# Altium schematic sheet Block Diagram.SchDoc: Block Diagram
size Tabloid; ApprovedBy: NA; CompanyName: Cospan Design LLC; DrawnBy: David McCoy; Engineer: David McCoy; DocumentNumber: 1; Revision: A; SheetNumber: 1; SheetTotal: 18; Client: OSH; Project: Guppy Buddy; ProjectPrettyName: Guppy Buddy
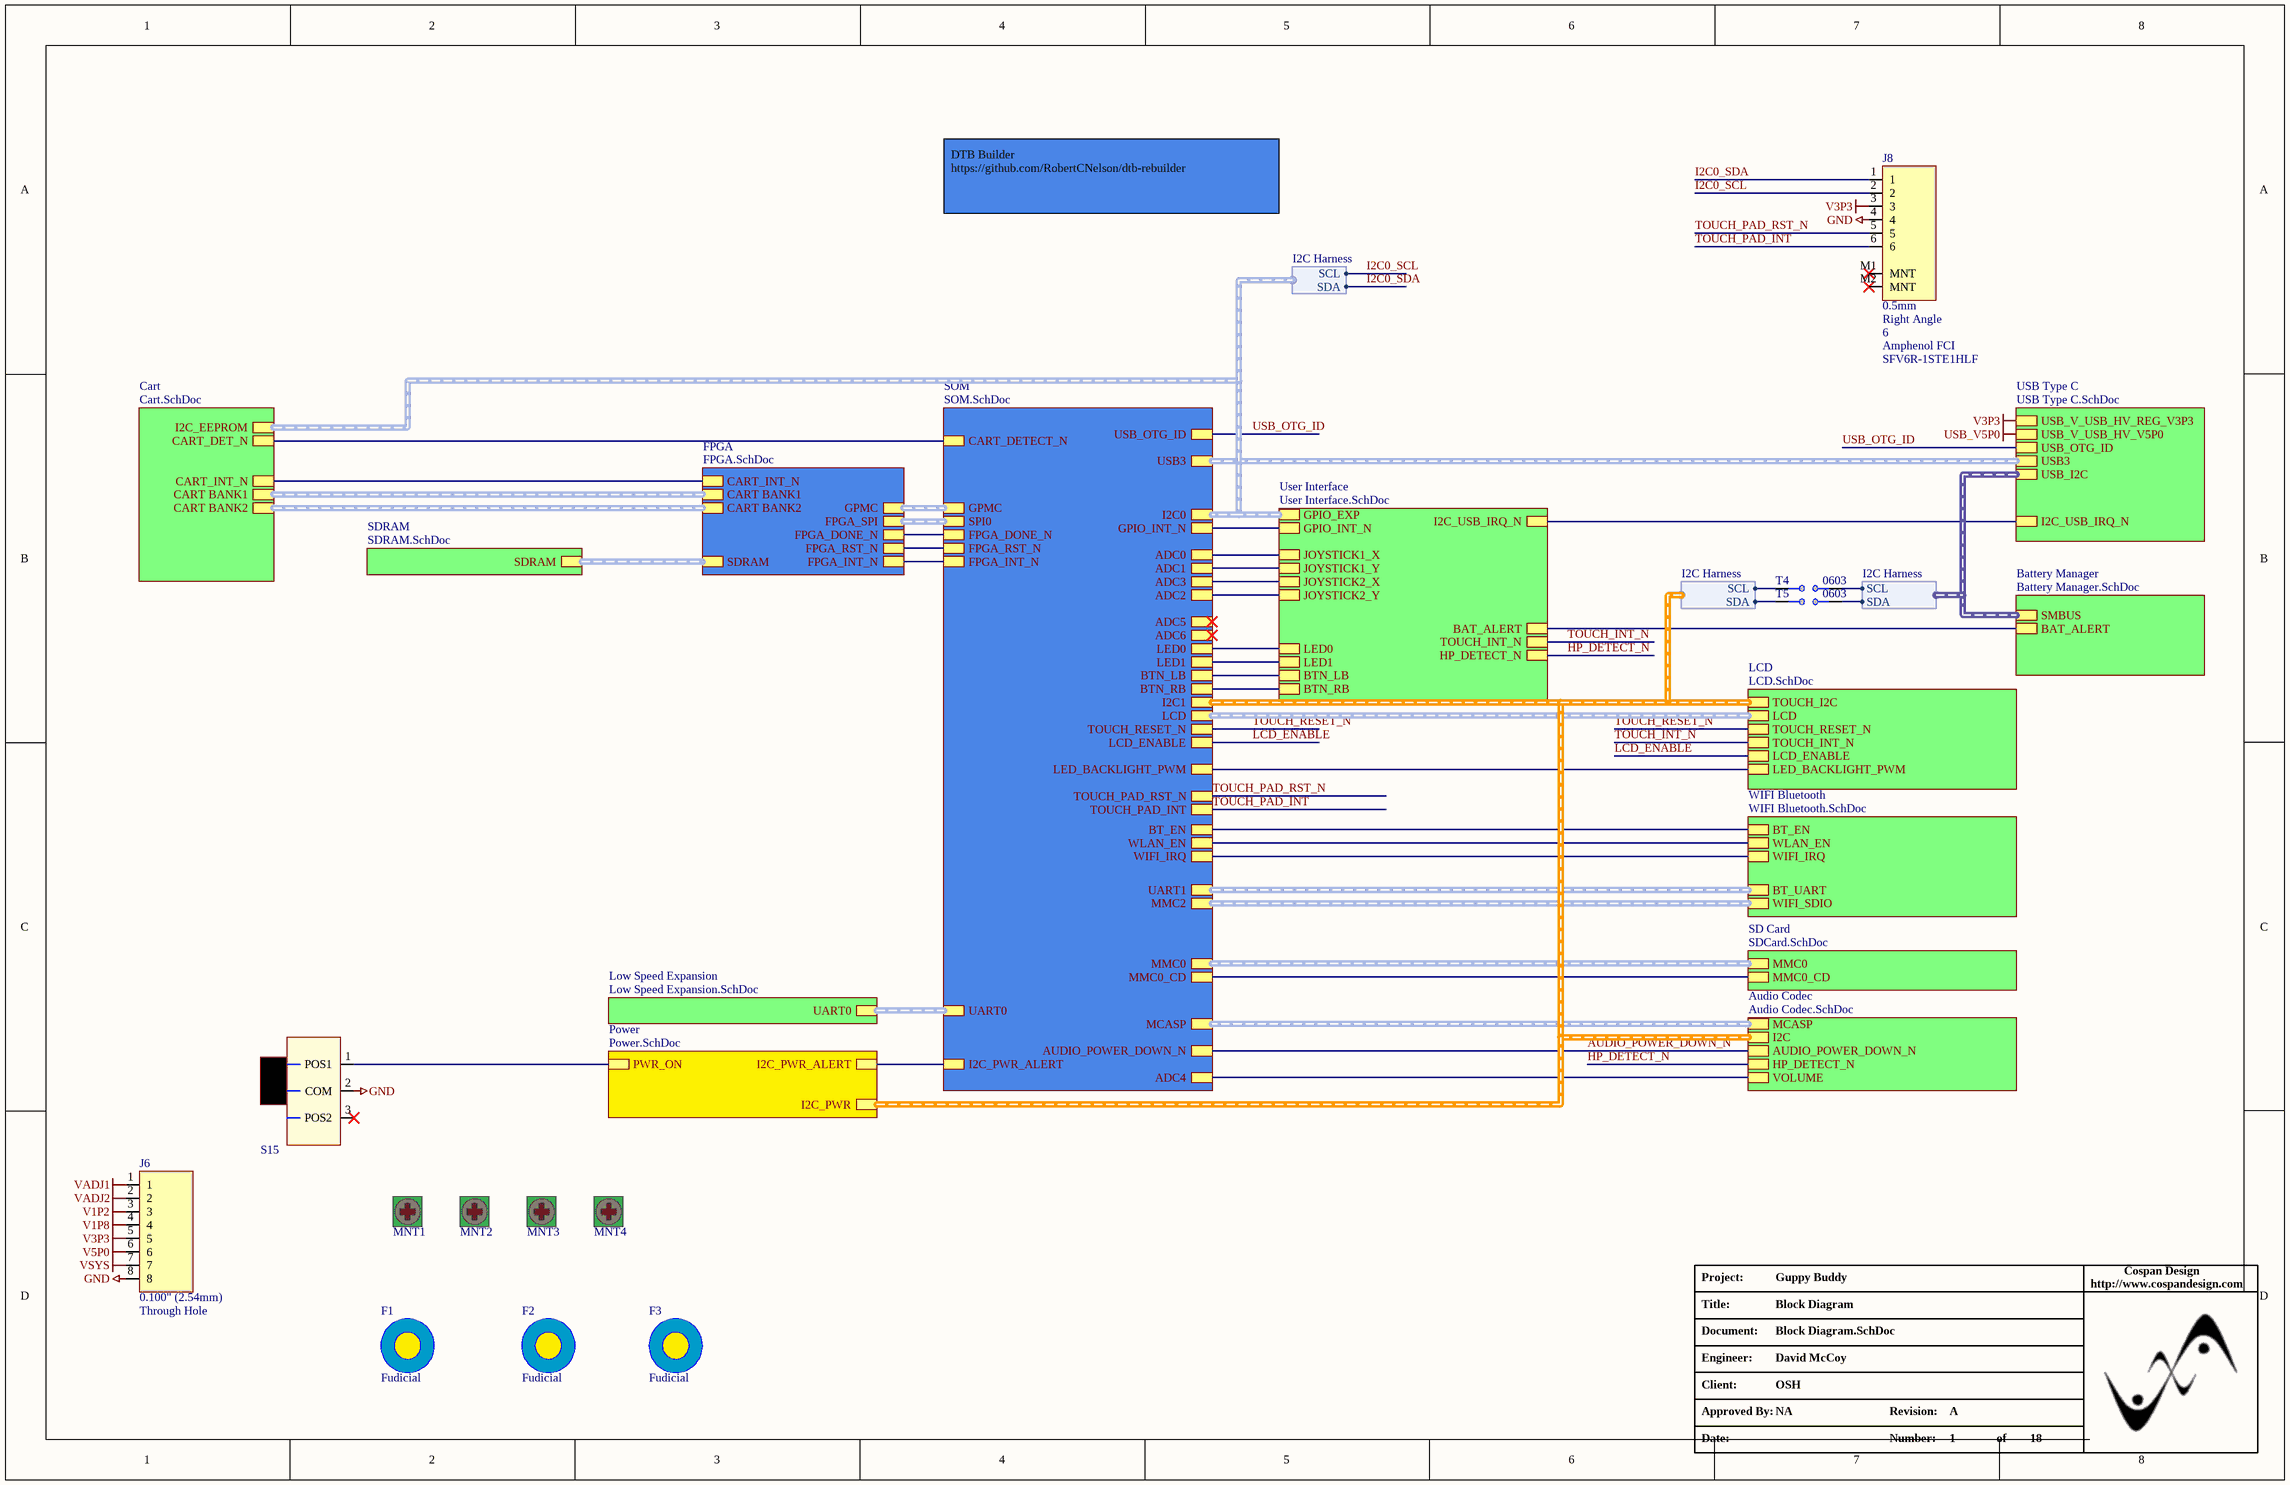
[diagram p0: Block Diagram.SchDoc]

## Parts
F1  Fudicial  [FIDUCIAL ROUND]  (no BOM)
F2  Fudicial  [FIDUCIAL ROUND]  (no BOM)
F3  Fudicial  [FIDUCIAL ROUND]  (no BOM)
J6  Pitch: 0.100" (2.54mm)  Mounting Type: Through Hole  [HDR_1X8 - HOLE]  (hidden comment: 1 X 8 HOLES)  (no BOM)
J8  Pitch: 0.5mm  Orientation: Right Angle  Number of Contacts: 6  Manufacturer 1: Amphenol FCI  Manufacturer Part Number 1: SFV6R-1STE1HLF  [FFC_6PIN]  (hidden comment: J_FFC_CONN_RA_6PIN)
MNT1  Mounting Hole  [MNT_4-40]  (value not drawn)  (no BOM)
MNT2  Mounting Hole  [MNT_4-40]  (value not drawn)  (no BOM)
MNT3  Mounting Hole  [MNT_4-40]  (value not drawn)  (no BOM)
MNT4  Mounting Hole  [MNT_4-40]  (value not drawn)  (no BOM)
S15  Micro Slide Switch  [PCM_SMD_SWITCH]  (value not drawn)
T4  Case: 0603  [ERA-0603-SOLDER_JUMPER]  (hidden comment: Place Solder Bridge to Enable)  (no BOM)
T5  Case: 0603  [ERA-0603-SOLDER_JUMPER]  (hidden comment: Place Solder Bridge to Enable)  (no BOM)

## Sub-sheets
Audio Codec = Audio Codec.SchDoc: MCASP (harness MCASP Harness), HP_DETECT_N, I2C (harness I2C Harness), AUDIO_POWER_DOWN_N, VOLUME
Battery Manager = Battery Manager.SchDoc: SMBUS (harness I2C Harness), BAT_ALERT
Cart = Cart.SchDoc: I2C_EEPROM (harness I2C Harness), CART_DET_N, CART_INT_N, CART BANK2 (harness CART BANK2 Harness), CART BANK1 (harness CART BANK1 Harness)
FPGA = FPGA.SchDoc: SDRAM (harness SDRAM Harness), GPMC (harness GPMC Harness), FPGA_DONE_N, FPGA_RST_N, FPGA_SPI (harness SPI Harness), CART_INT_N, CART BANK2 (harness CART BANK2 Harness), CART BANK1 (harness CART BANK1 Harness), FPGA_INT_N
LCD = LCD.SchDoc: LCD (harness LCD Harness), TOUCH_I2C (harness I2C Harness), TOUCH_INT_N, TOUCH_RESET_N, LCD_ENABLE, LED_BACKLIGHT_PWM
Low Speed Expansion = Low Speed Expansion.SchDoc: UART0 (harness UART Harness)
Power = Power.SchDoc: PWR_ON, I2C_PWR_ALERT, I2C_PWR (harness I2C Harness)
SD Card = SDCard.SchDoc: MMC0 (harness MMC Harness), MMC0_CD
SDRAM = SDRAM.SchDoc: SDRAM (harness SDRAM Harness)
SOM = SOM.SchDoc: USB3 (harness USB3 Harness), ADC5, ADC0, ADC6, ADC1, ADC2, ADC4, ADC3, MCASP (harness MCASP Harness), LCD (harness LCD Harness), UART0 (harness UART Harness), UART1 (harness UART Harness), I2C0 (harness I2C Harness), MMC2 (harness MMC Harness), MMC0 (harness MMC Harness), GPIO_INT_N, MMC0_CD, BT_EN, WLAN_EN, WIFI_IRQ, I2C1 (harness I2C Harness), LED_BACKLIGHT_PWM, TOUCH_RESET_N, USB_OTG_ID, LCD_ENABLE, AUDIO_POWER_DOWN_N, LED1, LED0, CART_DETECT_N, BTN_LB, BTN_RB, TOUCH_PAD_INT, GPMC (harness GPMC Harness), SPI0 (harness SPI Harness), FPGA_DONE_N, FPGA_RST_N, FPGA_INT_N, TOUCH_PAD_RST_N, I2C_PWR_ALERT
USB Type C = USB Type C.SchDoc: I2C_USB_IRQ_N, USB_V_USB_HV_REG_V3P3, USB3 (harness USB3 Harness), USB_V_USB_HV_V5P0, USB_I2C (harness I2C Harness), USB_OTG_ID
User Interface = User Interface.SchDoc: GPIO_EXP (harness I2C Harness), GPIO_INT_N, I2C_USB_IRQ_N, BAT_ALERT, TOUCH_INT_N, JOYSTICK1_X, JOYSTICK1_Y, JOYSTICK2_X, JOYSTICK2_Y, HP_DETECT_N, LED1, LED0, BTN_LB, BTN_RB
WIFI Bluetooth = WIFI Bluetooth.SchDoc: BT_EN, WLAN_EN, BT_UART (harness UART Harness), WIFI_SDIO (harness MMC Harness), WIFI_IRQ

## Harnesses
I2C Harness: SCL, SDA

## Nets
GND: J6.8 J8.4 S15.2(COM)
USB_V5P0: sheet USB Type C/USB_V_USB_HV_V5P0
V1P2: J6.3
V1P8: J6.4
V3P3: J6.5 J8.3 ; sheet USB Type C/USB_V_USB_HV_REG_V3P3
V5P0: J6.6
VADJ1: J6.1
VADJ2: J6.2
VSYS: J6.7
AUDIO_POWER_DOWN_N: sheet SOM/AUDIO_POWER_DOWN_N, sheet Audio Codec/AUDIO_POWER_DOWN_N
HP_DETECT_N: sheet User Interface/HP_DETECT_N, sheet Audio Codec/HP_DETECT_N
I2C0_SCL: J8.2 ; sheet SOM/I2C0.SCL
I2C0_SDA: J8.1 ; sheet SOM/I2C0.SDA
LCD_ENABLE: sheet SOM/LCD_ENABLE, sheet LCD/LCD_ENABLE
TOUCH_INT_N: sheet User Interface/TOUCH_INT_N, sheet LCD/TOUCH_INT_N
TOUCH_PAD_INT: J8.6 ; sheet SOM/TOUCH_PAD_INT
TOUCH_PAD_RST_N: J8.5 ; sheet SOM/TOUCH_PAD_RST_N
TOUCH_RESET_N: sheet SOM/TOUCH_RESET_N, sheet LCD/TOUCH_RESET_N
USB_OTG_ID: sheet USB Type C/USB_OTG_ID, sheet SOM/USB_OTG_ID
NetS15_1: S15.1(POS1) ; sheet Power/PWR_ON
NetT4_1: T4.1 ; sheet Battery Manager/SMBUS.SCL
NetT4_2: T4.2 ; sheet SOM/I2C1.SCL
NetT5_1: T5.1 ; sheet Battery Manager/SMBUS.SDA
NetT5_2: T5.2 ; sheet SOM/I2C1.SDA
(unnamed): sheet Battery Manager/BAT_ALERT, sheet User Interface/BAT_ALERT
(unnamed): sheet USB Type C/I2C_USB_IRQ_N, sheet User Interface/I2C_USB_IRQ_N
(unnamed): sheet SOM/ADC0, sheet User Interface/JOYSTICK1_X
(unnamed): sheet SOM/ADC1, sheet User Interface/JOYSTICK1_Y
(unnamed): sheet SOM/ADC2, sheet User Interface/JOYSTICK2_Y
(unnamed): sheet SOM/ADC4, sheet Audio Codec/VOLUME
(unnamed): sheet SOM/ADC3, sheet User Interface/JOYSTICK2_X
(unnamed): sheet SOM/GPIO_INT_N, sheet User Interface/GPIO_INT_N
(unnamed): sheet SOM/MMC0_CD, sheet SD Card/MMC0_CD
(unnamed): sheet SOM/BT_EN, sheet WIFI Bluetooth/BT_EN
(unnamed): sheet SOM/WLAN_EN, sheet WIFI Bluetooth/WLAN_EN
(unnamed): sheet SOM/WIFI_IRQ, sheet WIFI Bluetooth/WIFI_IRQ
(unnamed): sheet SOM/LED_BACKLIGHT_PWM, sheet LCD/LED_BACKLIGHT_PWM
(unnamed): sheet SOM/LED1, sheet User Interface/LED1
(unnamed): sheet SOM/LED0, sheet User Interface/LED0
(unnamed): sheet SOM/CART_DETECT_N, sheet Cart/CART_DET_N
(unnamed): sheet SOM/BTN_LB, sheet User Interface/BTN_LB
(unnamed): sheet SOM/BTN_RB, sheet User Interface/BTN_RB
(unnamed): sheet SOM/FPGA_DONE_N, sheet FPGA/FPGA_DONE_N
(unnamed): sheet SOM/FPGA_RST_N, sheet FPGA/FPGA_RST_N
(unnamed): sheet SOM/FPGA_INT_N, sheet FPGA/FPGA_INT_N
(unnamed): sheet SOM/I2C_PWR_ALERT, sheet Power/I2C_PWR_ALERT
(unnamed): sheet Cart/CART_INT_N, sheet FPGA/CART_INT_N

Not connected (* = marked no-connect by the designer): J8 M1(MNT)* M2(MNT)*; S15 3(POS2)*

## Buses and harness runs
harness sheet Audio Codec/I2C = sheet LCD/TOUCH_I2C = sheet Power/I2C_PWR = sheet SOM/I2C1
harness sheet Audio Codec/MCASP = sheet SOM/MCASP
harness sheet Battery Manager/SMBUS = sheet USB Type C/USB_I2C
harness sheet Cart/CART BANK1 = sheet FPGA/CART BANK1
harness sheet Cart/CART BANK2 = sheet FPGA/CART BANK2
harness sheet Cart/I2C_EEPROM = sheet SOM/I2C0 = sheet User Interface/GPIO_EXP
harness sheet FPGA/FPGA_SPI = sheet SOM/SPI0
harness sheet FPGA/GPMC = sheet SOM/GPMC
harness sheet FPGA/SDRAM = sheet SDRAM/SDRAM
harness sheet LCD/LCD = sheet SOM/LCD
harness sheet Low Speed Expansion/UART0 = sheet SOM/UART0
harness sheet SD Card/MMC0 = sheet SOM/MMC0
harness sheet SOM/MMC2 = sheet WIFI Bluetooth/WIFI_SDIO
harness sheet SOM/UART1 = sheet WIFI Bluetooth/BT_UART
harness sheet SOM/USB3 = sheet USB Type C/USB3

## Notes on the sheet
- DTB Builder
  https://github.com/RobertCNelson/dtb-rebuilder
- Project:
- http://www.cospandesign.com
- Cospan Design
- Document:
- Engineer:
- Title:
- Client:
- Approved By:
- Revision:
- Date:
- Number:
- of

## Library data of the parts
F1-F3 = F_FUDICIAL
J6 = J_HDR1X8_HOLES
J8 = J_FFC_CONN_RA_6PIN: CONN FFC BOTTOM 6POS 0.50MM R/A; Description 1: 6 Position FFC, FPC Connector Contacts, Bottom 0.020" (0.50mm) Surface Mount, Right Angle; Actuator Material: Glass,Polyphenylene; Current Rating: 500mA; Voltage Rating: 50V; Contact Resistance: 30mR; Insulation Resistance: 100MR; Wire/Cable Type: Straight; ComponentLink1URL: http://portal.fciconnect.com/Comergent//fci/drawing/10112793.pdf; ComponentLink1Description: http://portal.fciconnect.com/Comergent//fci/drawing/10112793.pdf; Stock 1: 13673; Mount: Surface Mount; Contact Material: Bronze; Contact Plating: Tin; Housing Colour: Black; Housing Material: Polyamide; Min Operating Temperature: -55°C; Max Operating Temperature: 105°C; Number of Rows: 1; Termination: Solder; Package Quantity: 3000; Packaging: Tape and Reel; Number of Positions: 6; Contact Location: Bottom; Max Voltage Rating (AC): 50V; Max Voltage Rating (DC): 50V; Length: 8.5mm; Depth: 4.9mm; Radiation Hardening: No; Lead Free: Lead Free; Flammability Rating: UL94 V-0; ComponentLink2URL: https://cdn.amphenol-icc.com/media/wysiwyg/files/drawing/10112793.pdf; ComponentLink2Description: https://cdn.amphenol-icc.com/media/wysiwyg/files/drawing/10112793.pdf; ComponentLink3URL: http://portal.fciconnect.com/Comergent/fci/drawing/10112793.pdf; ComponentLink3Description: http://portal.fciconnect.com/Comergent/fci/drawing/10112793.pdf; ComponentLink4URL: https://www.verical.com/server-webapp/html/getDatasheet?partID=347449; ComponentLink4Description: https://www.verical.com/server-webapp/html/getDatasheet?partID=347449; Pricing 1: 1=0.77, 10=0.681, 25=0.6408, 50=0.614, 100=0.5873, 250=0.53396, 500=0.48054, 1000=0.42715 (USD); Supplier 1: Digi-Key; Supplier Part Number 1: 609-4332-1-ND
MNT1-MNT4 = MNT?
S15 = S_MICRO_SLIDE_SWITCH_ON_OFF: SWITCH SLIDE SPDT 300MA 6V; Manufacturer: C&K Components; Manufacturer Part Number: PCM12SMTR; Contact Timing: Not Specified; Switch Function: On-On; Current Rating: 300mA (DC); Actuator Type: Standard; Actuator Length: 1.50mm; Actuator Material: Polyamide (PA46), Nylon 4/6; Mechanical Life: 10,000 Cycles; Supplier 1: Digi-Key; RoHS: RoHS Compliant; Category: Switches; Stock 1: 29326; Pricing 1: 1=0.82, 10=0.787, 25=0.7704, 50=0.6884, 100=0.6556, 250=0.6392, 500=0.54088, 1000=0.52448 (USD); Packaging: Cut Tape (CT); Circuit: SPDT; Voltage Rating - AC: -; Voltage Rating - DC: 6V; Contact Material: Copper Alloy; Contact Finish: Silver; Mounting Type: Surface Mount, Right Angle; Termination Style: Gull Wing; Features: -; Switch Travel: 1.50mm; Operating Temperature: -20°C ~ 85°C; Electrical Life: -; Operating Force: -; ComponentLink1URL: http://www.ck-components.com/index.php?module=media&action=Display&cmpref=14389&lang=en&width=&height=&format=&alt=; ComponentLink1Description: http://www.ck-components.com/index.php?module=media&action=Display&cmpref=14389&lang=en&width=&height=&format=&alt=; Supplier Part Number 1: 401-2016-1-ND
T4 T5 = T_0603_JUMPER_PAD: SOLDER_JUMPER PAD